# Altium schematic sheet Sheet1.SchDoc
size A
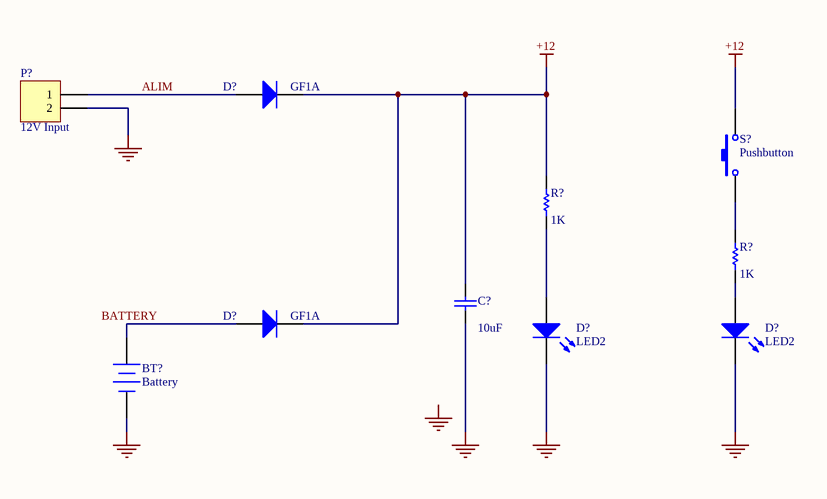
[diagram p0: Sheet1.SchDoc]

## Parts
(Parts that share a designator on the sheet are numbered #1, #2 ... from top to bottom, then left to right.)
BT?  Battery  [BAT-2]
C?  value 10uF  [C1206]  (hidden comment: Cap Semi)
D?#1  GF1A  [SMC]
D?#2  GF1A  [SMC]
D?#3  LED2  [3.2X1.6X1.1]
D?#4  LED2  [3.2X1.6X1.1]
P?  12V Input  [HDR1X2]
R?#1  value 1K  [AXIAL-0.3]  (hidden comment: Res1)
R?#2  value 1K  [AXIAL-0.3]  (hidden comment: Res1)
S?  Pushbutton  [SPST-2]

## Nets
+12: C?.2 D?#1.2(K) D?#2.2(K) R?#1.2 S?.2
GND: BT?.2(-) C?.1 D?#3.2(K) D?#4.2(K) P?.2
ALIM: D?#1.1(A) P?.1
NetBT?_1: BT?.1(+) D?#2.1(A)
NetD?#3_1: D?#3.1(A) R?#1.1
NetD?#4_1: D?#4.1(A) R?#2.1
NetR?#2_2: R?#2.2 S?.1

## Notes on the sheet
- Labels drawn without touching a wire or pin: BATTERY, GND

## Library data of the parts
BT? = Battery: Multicell Battery; Published: 24-Mar-1999; LatestRevisionDate: 17-Jul-2002; LatestRevisionNote: Re-released for DXP Platform.; PackageReference: BAT-2; Publisher: Altium Limited; PackageDescription: Battery; 2 Leads; Fabriquant: *; RefFabriquant: *; Fournisseur: *; RefFournisseur: *
C? = Cap Semi: Capacitor (Semiconductor SIM Model); Published: 8-Jun-2000; LatestRevisionDate: 29-May-2009; LatestRevisionNote: IPC-7351 Footprint Added.; PackageReference: C1206; Publisher: Altium Limited; PackageDescription: Chip Capacitor
D?#1 D?#2 = Diode: Default Diode; Published: 8-Jun-2000; LatestRevisionDate: 17-Jul-2002; LatestRevisionNote: Re-released for DXP Platform.; PackageVersion: Sep-1996; PackageReference: SMC; Publisher: Altium Limited; PackageDescription: DO-214-AB/SMC; 2 C-Bend Leads; Body 7.9 x 5.9 mm, inc. leads (LxW); Code_JEDEC: DO-214-AB; Fabriquant: *; RefFabriquant: *; Fournisseur: *; RefFournisseur: *
D?#3 D?#4 = LED2: Typical RED, GREEN, YELLOW, AMBER GaAs LED; Published: 8-Jun-2000; LatestRevisionDate: 17-Jul-2002; LatestRevisionNote: Re-released for DXP Platform.; PackageVersion: Feb-2002; PackageReference: 3.2X1.6X1.1; Publisher: Altium Limited; PackageDescription: SM LED; 2 Flat Leads
P? = Header 2: Header, 2-Pin; LatestRevisionDate: 17-Jul-2002; LatestRevisionNote: Re-released for DXP Platform.; Publisher: Altium Limited
R?#1 R?#2 = Res1: Resistor; Published: 8-Jun-2000; LatestRevisionDate: 17-Jul-2002; LatestRevisionNote: Re-released for DXP Platform.; PackageReference: AXIAL-0.3; Publisher: Altium Limited; PackageDescription: Axial Device, Thru-Hole; 2 Leads; 0.3 in Pin Spacing
S? = SW-PB: Switch; Published: 24-Mar-1999; LatestRevisionDate: 17-Jul-2002; LatestRevisionNote: Re-released for DXP Platform.; PackageReference: SPST-2; Publisher: Altium Limited; PackageDescription: Switch; 2 Leads